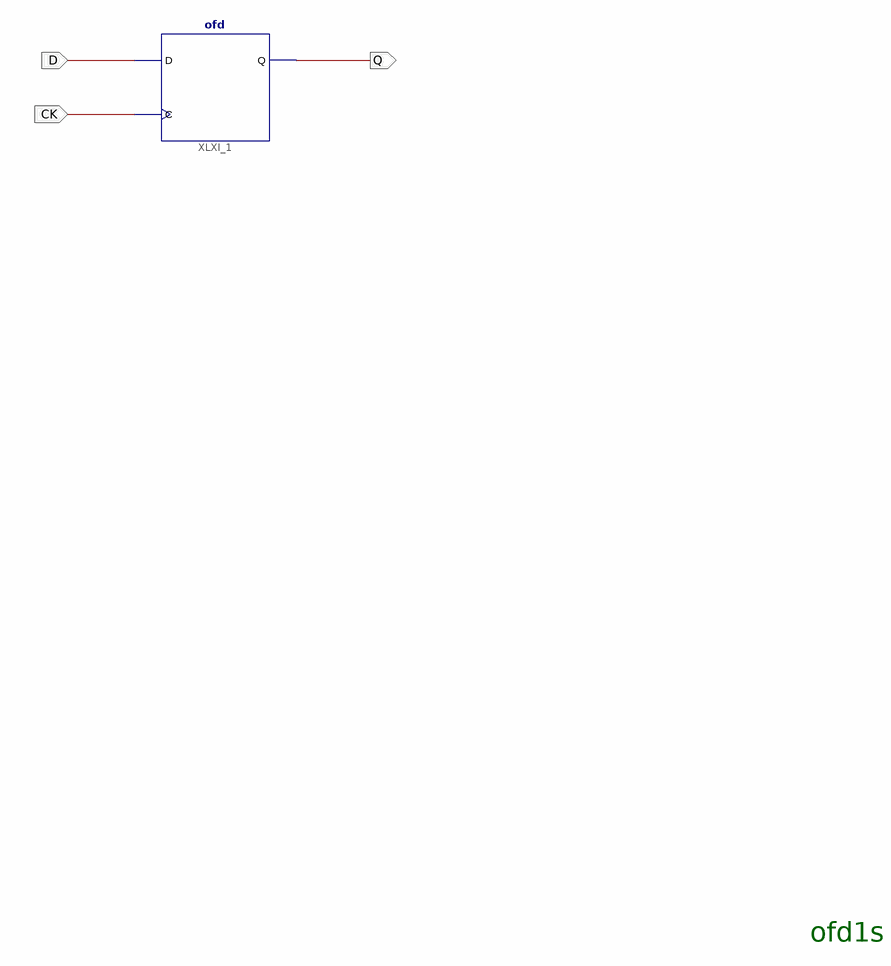
[diagram p0: schematic sheet 1]
// Xilinx ISE schematic ofd1s.sch (spartan6) as structural Verilog: 1 symbols, 3 ports
module ofd1s (
  input  D,
  input  CK,
  output Q
);

  ofd XLXI_1 (.C(CK), .D(D), .Q(Q));

  // Notes on the sheet:
  //   ofd1s
endmodule
